# Altium schematic sheet a.SchDoc
size A; Organization: Smart Product Design Lab; Address1: 201 Thornton; Address2: Stanford University; Address3: Stanford, CA; Address4: 94305-4021
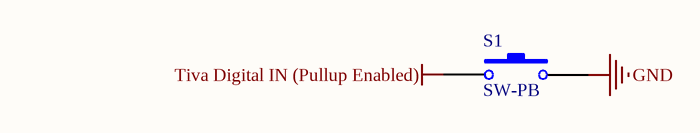
[diagram p0: a.SchDoc]

## Parts
S1  SW-PB  [SPST-2]

## Nets
GND: S1.2
Tiva Digital IN (Pullup Enabled): S1.1

## Notes on the sheet
- Title
- Size:
- Date:
- File:
- A
- Number:
- Time:
- Revision:
- Sheet
- of
- Drawn By:

## Library data of the parts
S1 = SW-PB: Switch; Manufacturer: Generic Components; Published: 1999